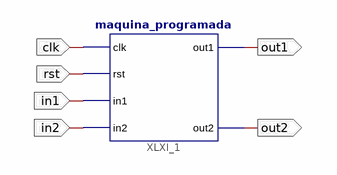
[diagram p0: schematic sheet 1]
// Xilinx ISE schematic schematic_maquina.sch (spartan6) as structural Verilog: 1 symbols, 6 ports
module schematic_maquina (
  input  clk,
  input  rst,
  input  in1,
  input  in2,
  output out1,
  output out2
);

  maquina_programada XLXI_1 (.clk(clk), .rst(rst), .in1(in1), .in2(in2), .out1(out1), .out2(out2));
endmodule
